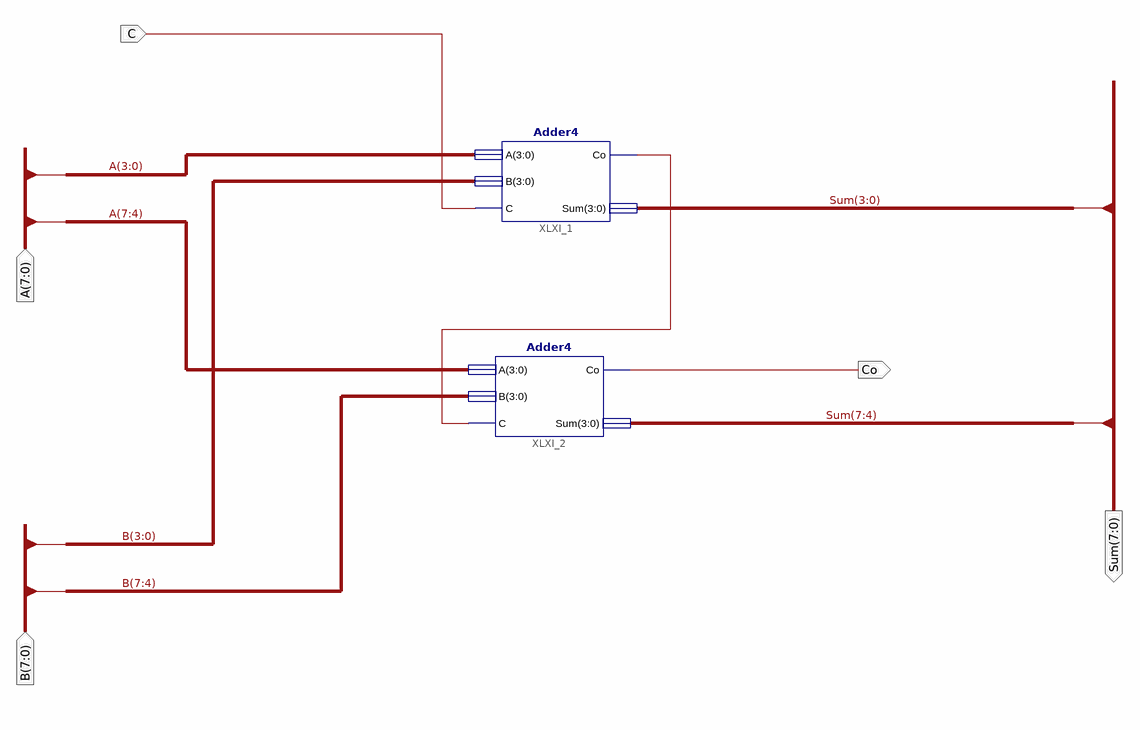
[diagram p0: schematic sheet 1]
// Xilinx ISE schematic Adder8.sch (kintex7) as structural Verilog: 2 symbols, 5 ports
module Adder8 (
  input  [7:0] A,
  input  [7:0] B,
  input  C,
  output [7:0] Sum,
  output Co
);

  wire XLXN_12;

  Adder4 XLXI_1 (.A(A[3:0]), .B(B[3:0]), .C(C), .Co(XLXN_12), .Sum(Sum[3:0]));
  Adder4 XLXI_2 (.A(A[7:4]), .B(B[7:4]), .C(XLXN_12), .Co(Co), .Sum(Sum[7:4]));
endmodule
